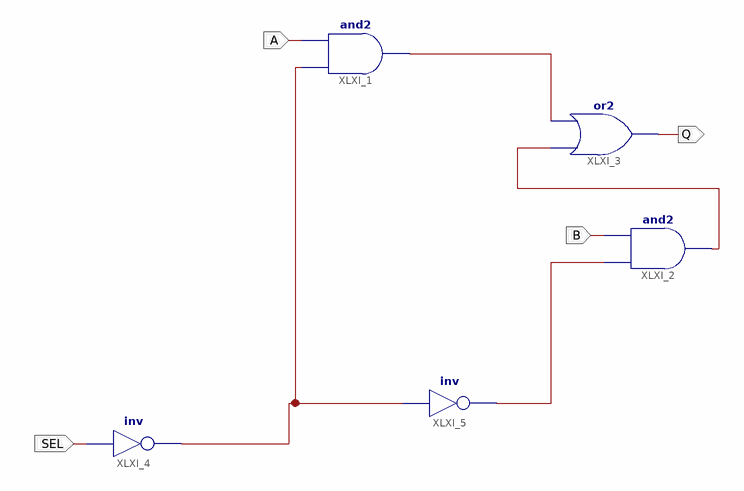
[diagram p0: schematic sheet 1]
// Xilinx ISE schematic data_selector.sch (spartan6) as structural Verilog: 5 symbols, 4 ports
module data_selector (
  input  A,
  input  B,
  input  SEL,
  output Q
);

  wire XLXN_4, XLXN_5, XLXN_6, XLXN_11;

  and XLXI_1 (XLXN_6, XLXN_11, A);
  and XLXI_2 (XLXN_5, XLXN_4, B);
  or XLXI_3 (Q, XLXN_5, XLXN_6);
  not XLXI_4 (XLXN_11, SEL);
  not XLXI_5 (XLXN_4, XLXN_11);
endmodule
